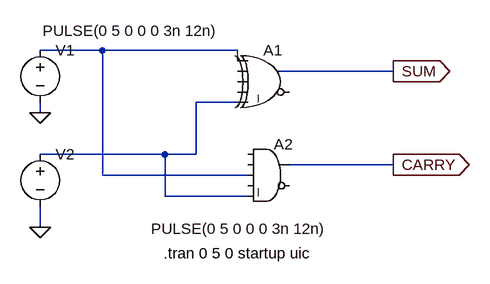
[diagram p0: schematic Half Adder.asc]
Half Adder.asc, the LTspice schematic file:
Version 4
SHEET 1 880 680
WIRE -96 48 -192 48
WIRE 112 48 -96 48
WIRE 112 64 112 48
WIRE 352 80 176 80
WIRE 112 128 48 128
WIRE -192 144 -192 128
WIRE 0 208 -192 208
WIRE 48 208 48 128
WIRE 48 208 0 208
WIRE 352 224 192 224
WIRE -96 240 -96 48
WIRE 128 240 -96 240
WIRE 0 272 0 208
WIRE 128 272 0 272
WIRE -192 320 -192 288
FLAG 352 80 SUM
IOPIN 352 80 Out
FLAG 352 224 CARRY
IOPIN 352 224 Out
FLAG -192 144 0
FLAG -192 320 0
SYMBOL Digital\\and 160 176 R0
SYMATTR InstName A2
SYMBOL Digital\\xor 160 32 R0
SYMATTR InstName A1
SYMBOL voltage -192 32 R0
WINDOW 3 4 -14 Left 2
WINDOW 123 0 0 Left 0
WINDOW 39 0 0 Left 0
SYMATTR InstName V1
SYMATTR Value PULSE(0 5 0 0 0 3n 12n)
SYMBOL voltage -192 192 R0
WINDOW 3 171 130 Left 2
WINDOW 123 0 0 Left 0
WINDOW 39 0 0 Left 0
SYMATTR InstName V2
SYMATTR Value PULSE(0 5 0 0 0 3n 12n)
TEXT -2 360 Left 2 !.tran 0 5 0 startup uic

The netlist it stands for:
* Half Adder.asc
A2 0 0 N001 0 N002 0 CARRY 0 AND
A1 N001 0 0 0 N002 0 SUM 0 XOR
V1 N001 0 PULSE(0 5 0 0 0 3n 12n)
V2 N002 0 PULSE(0 5 0 0 0 3n 12n)
.tran 0 5 0 startup uic
.backanno
.end